# EasyEDA Pro project ProPrj_ArpGlass_2025-06-13_16-35-24_2025-06-13.epro, board PCB_ArpGlass
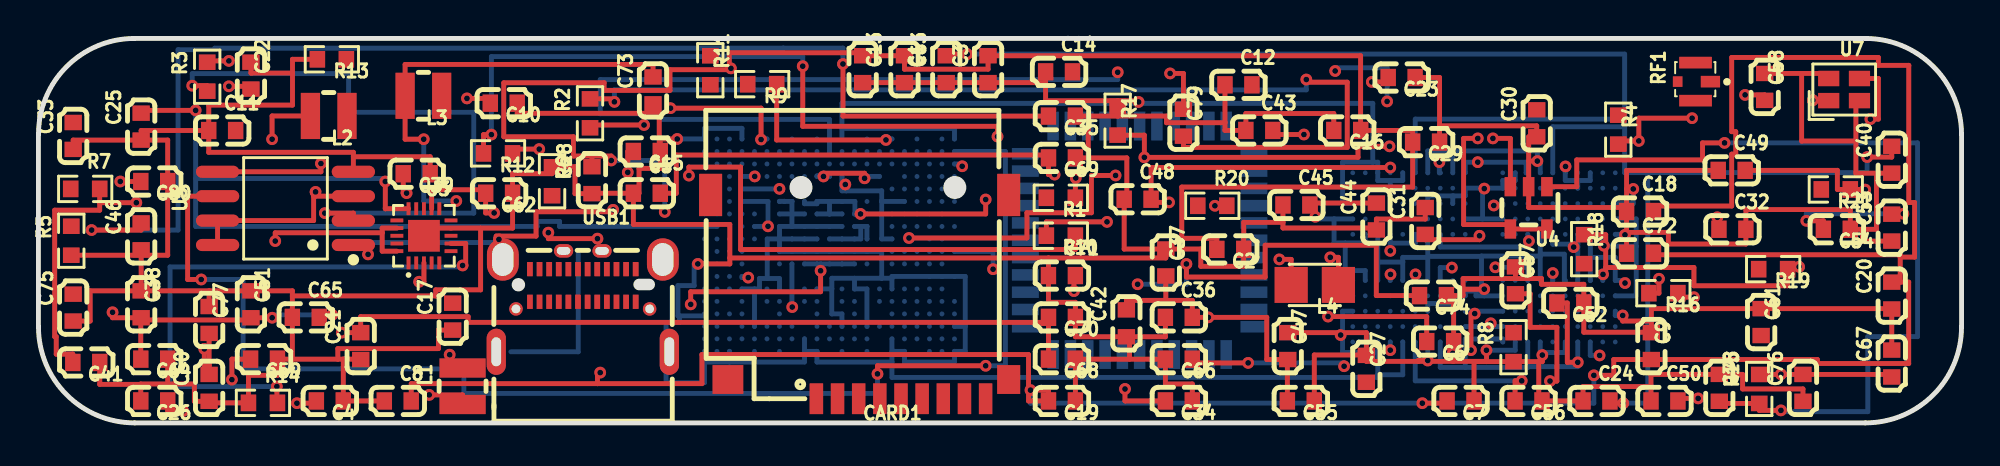
[diagram p1: board, top side]
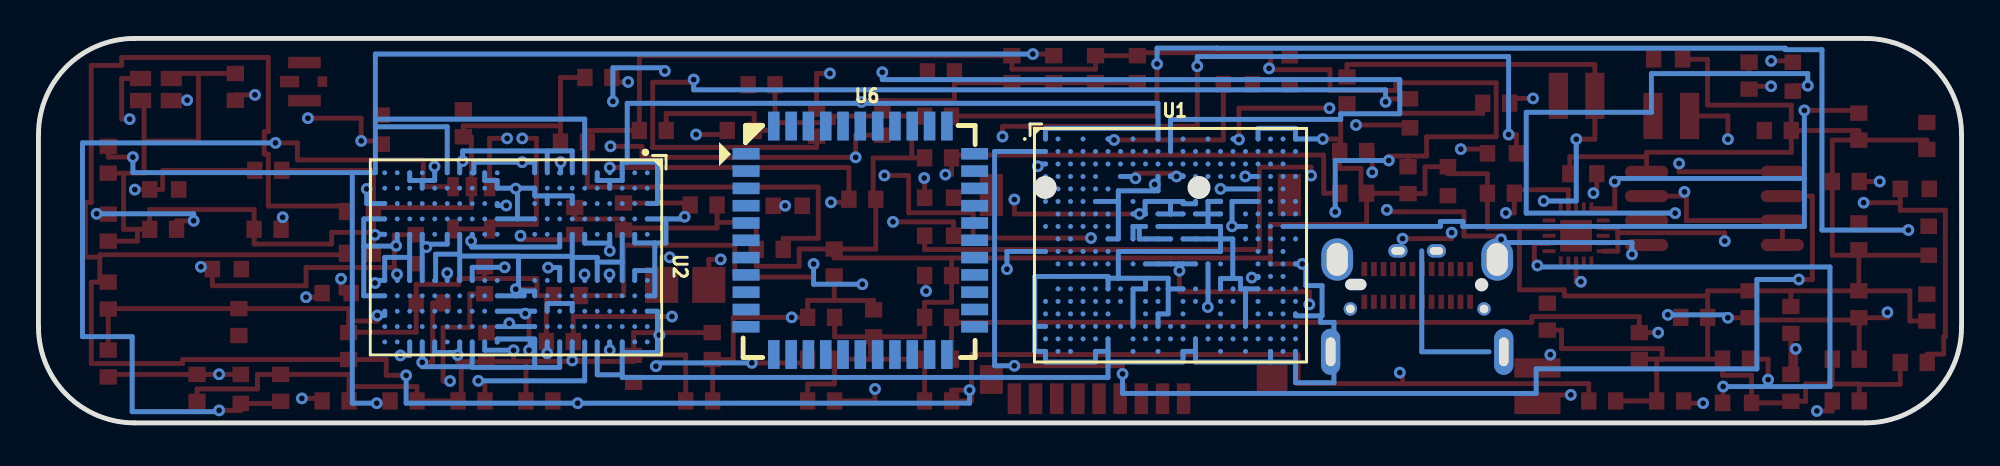
[diagram p2: board, bottom side, seen from below]

Outline 100 x 20 mm; copper layers: Top Layer, GND, Inner2, Bottom Layer. Coordinates in mm from the lower left corner of the outline.
Outline path: 0,15 arc(1.46,18.54) 5,20 95,20 arc(98.54,18.54) 100,15 100,5 arc(98.54,1.46) 95,0 5,0 arc(1.46,1.46) 0,5 0,15
Stack: Top Layer 0.035mm / Dielectric1 0.48mm PP er 4.5 / GND 0.035mm / Dielectric2 0.48mm FR4 er 4.5 / Inner2 0.035mm / Dielectric3 0.48mm PP er 4.5 / Bottom Layer 0.035mm

## Design rules (mm)
template: User Custom Config
spacing Default (default): track to track 0.152, other pairs 0 to 0.152
track width Default (default): min 0.254, default 0.254, max 25.4
differential pair differentialPair (default): width min 0.127, default 0.254, max 2.54; gap min 0.152, default 0.152
via Default (default): diameter min 0.61, default 0.61, max 100.025; hole min 0.305, default 0.305, max 59.995

## Placement (name value [footprint] x y rotation side)
C1  2.2uf  [C0603]  45.03 18.4 270 top
C2  100nf  [C0603]  61.97 9.03 180 top
C3  22uf  [C0603]  49.38 18.4 90 top
C4  22uf  [C0603]  15.15 1.14 180 top
C5  22uf  [C0603]  31.64 11.95 0 top
C6  22uf  [C0603]  72.89 4.23 180 top
C7  22uf  [C0603]  73.95 1.14 180 top
C8  22uf  [C0603]  18.69 1.14 0 top
C9  22uf  [C0603]  83.87 4 270 top
C10  10uf  [C0603]  24.2 16.63 180 top
C11  220nf  [C0603]  9.55 15.21 0 top
C12  1uf  [C0603]  62.4 17.59 0 top
C13  100nf  [C0603]  42.86 18.4 270 top
C14  470nf  [C0603]  53.07 18.26 0 top
C15  1uf  [C0603]  31.64 14.12 180 top
C16  2.2uf  [C0603]  68.06 15.21 180 top
C17  470nf  [C0603]  21.54 5.53 90 top
C18  2.2uf  [C0603]  83.28 11 0 top
C19  2.2uf  [C0603]  53.22 1.14 180 top
C20  2.2uf  [C0603]  96.37 6.62 90 top
C21  2.2uf  [C0603]  16.76 4 90 top
C22  2.2uf  [C0603]  11.05 18.07 270 top
C23  2.2uf  [C0603]  70.89 17.97 180 top
C24  10uf  [C0603]  81.02 1.14 0 top
C25  2.2uf  [C0603]  5.34 15.41 90 top
C26  10uf  [C0603]  6.02 1.14 180 top
C27  100nf  [C0603]  69.05 2.81 270 top
C28  100nf  [C0603]  28.78 12.63 90 top
C29  100nf  [C0603]  72.16 14.61 180 top
C30  100nf  [C0603]  77.91 15.58 90 top
C31  12pf  [C0603]  72.11 10.5 90 top
C32  12pf  [C0603]  88.09 10.07 0 top
C33  1nf  [C0603]  1.81 14.93 90 top
C34  22uf  [C0603]  59.3 1.14 180 top
C35  2.2nf  [C0603]  53.22 15.96 180 top
C36  1uf  [C0603]  59.3 5.49 0 top
C37  1uf  [C0603]  58.62 8.34 270 top
C38  2.2nf  [C0603]  5.34 6.17 270 top
C39  2.2nf  [C0603]  19.67 12.96 180 top
C40  1uf  [C0603]  96.37 13.69 90 top
C41  100nf  [C0603]  2.49 3.14 180 top
C42  100nf  [C0603]  56.57 5.18 90 top
C43  100nf  [C0603]  63.49 15.21 0 top
C44  100nf  [C0603]  69.57 10.74 90 top
C45  1uf  [C0603]  65.41 11.34 0 top
C46  1uf  [C0603]  5.34 9.7 90 top
C47  1uf  [C0603]  64.96 4 270 top
C48  100nf  [C0603]  57.16 11.63 0 top
C49  100nf  [C0603]  88.05 13.14 0 top
C50  1uf  [C0603]  84.55 1.14 0 top
C51  1uf  [C0603]  11.05 6.17 270 top
C52  1uf  [C0603]  79.66 6.24 180 top
C53  100nf  [C0603]  96.37 10.16 90 top
C54  100nf  [C0603]  93.52 10.07 180 top
C55  100nf  [C0603]  65.64 1.14 180 top
C56  100nf  [C0603]  77.48 1.14 180 top
C57  1uf  [C0603]  76.8 7.42 270 top
C58  22uf  [C0603]  89.76 17.48 270 top
C59  4.7uf  [C0603]  11.73 3.32 180 top
C60  22uf  [C0603]  8.87 1.82 90 top
C61  1uf  [C0603]  89.58 5.24 270 top
C62  22uf  [C0603]  23.95 11.95 180 top
C63  22uf  [C0603]  47.21 18.4 90 top
C64  22uf  [C0603]  6.02 3.32 180 top
C65  1uf  [C0603]  13.9 5.49 0 top
C66  22uf  [C0603]  59.3 3.32 180 top
C67  22uf  [C0603]  96.37 3.09 90 top
C68  22uf  [C0603]  53.22 3.32 180 top
C69  22uf  [C0603]  53.22 13.79 180 top
C70  1uf  [C0603]  53.22 5.49 180 top
C71  1uf  [C0603]  53.22 7.66 0 top
C72  22uf  [C0603]  83.28 8.82 0 top
C73  22uf  [C0603]  31.96 17.3 90 top
C74  1nf  [C0603]  72.52 6.62 180 top
C75  100nf  [C0603]  1.81 6 90 top
C76  100nf  [C0603]  91.75 1.82 90 top
C77  22uf  [C0603]  8.87 5.36 270 top
C78  100nf  [C0603]  87.41 1.82 270 top
C79  12pf  [C0603]  59.54 15.62 270 top
C80  22uf  [C0603]  6.02 12.56 180 top
CARD1  TF PUSH  [TF-SMD_TF-PUSH]  42.7 6.56 180 top
L1  1uH  [IND-SMD_L2.5-W2.0_AHP252010X]  22.05 1.91 90 top
L2  1uH  [IND-SMD_L2.5-W2.0_AHP252010X]  15.09 15.97 180 top
L3  1uH  [IND-SMD_L2.5-W2.0_AHP252010X]  20.02 17.02 180 top
L4  2.2uH  [IND-SMD_L2.5-W2.0_WPN252012H]  66.37 7.18 180 top
R1  10  [R0603]  53.16 11.71 180 top
R2  10k  [R0603]  28.68 16.1 90 top
R3  10k  [R0603]  8.77 18.01 90 top
R4  10k  [R0603]  82.15 15.25 270 top
R5  150k  [R0603]  1.71 9.48 90 top
R6  10k  [R0603]  26.71 12.57 270 top
R7  20k  [R0603]  2.43 12.17 0 top
R8  6.04k  [R0603]  76.7 3.94 90 top
R9  10  [R0603]  37.63 17.62 180 top
R10  10k  [R0603]  53.16 9.74 180 top
R11  0  [R0603]  34.94 18.35 270 top
R12  100  [R0603]  23.9 14.02 180 top
R13  240  [R0603]  15.26 18.92 180 top
R14  510  [R0603]  11.67 1.04 0 top
R15  10k  [R0603]  89.48 1.77 90 top
R16  232k  [R0603]  84.5 6.75 180 top
R17  49.9k  [R0603]  56.12 15.72 270 top
R18  240  [R0603]  80.38 9.04 270 top
R19  240  [R0603]  90.2 8 180 top
R20  100k  [R0603]  61.04 11.3 0 top
R21  100k  [R0603]  93.46 12.15 180 top
RF1  IPEX-4  [IPEX-SMD_4P-L1.8-W1.7-LS2.0]  86.09 17.75 90 top
U1  H616_C5365289  [BGA-284_L14.0-W12.0-P0.65-TL]  41.13 9.25 180 bottom
U2  K4F8E304HB-MGCJ  [BGA-200_L15.0-W10.0_K4F8E304HB-MGCJ]  75.17 8.61 270 bottom
U3  AXP313A_C5365290  [QFN-20_L3.0-W3.0-P0.40-BL-EP1.7]  20.04 9.73 0 top
U4  SY8089AAC  [SOT-23-5_L2.9-W1.6-P0.95-LS2.8-BL]  77.49 11.19 180 top
U5  W25Q128JWSIQ  [SOIC-8_L5.3-W5.3-P1.27-LS8.0-BL]  12.84 11.16 90 top
U6  -  [COMM-SMD-44_L12.0-W12.0-P0.90-TL_BL-R8189FTV]  57.26 9.5 180 bottom
U7  24MHz  [CRYSTAL-SMD_4P-L2.0-W1.6-BL-2]  93.89 17.34 0 top
USB1  UT12113-11601-7H  [USB-C-SMD_UT12113-11601-7H]  28.31 6.32 0 top

## Footprints (pads in the part's own frame, mm; a bottom-side part is the same pattern mirrored in y, then rotated)
BGA-200_L15.0-W10.0_K4F8E304HB-MGCJ
  round 0.248 smd: A1(-4.4,6.825) A2(-3.6,6.825) A3(-2.8,6.825) A4(-2,6.825) A5(-1.2,6.825) A8(1.2,6.825) A9(2,6.825) A10(2.8,6.825) A11(3.6,6.825) A12(4.4,6.825) AA1(-4.4,-6.175) AA2(-3.6,-6.175) AA3(-2.8,-6.175) AA4(-2,-6.175) AA5(-1.2,-6.175) AA8(1.2,-6.175) AA9(2,-6.175) AA10(2.8,-6.175) AA11(3.6,-6.175) AA12(4.4,-6.175) AB1(-4.4,-6.825) AB2(-3.6,-6.825) AB3(-2.8,-6.825) AB4(-2,-6.825) AB5(-1.2,-6.825) AB8(1.2,-6.825) AB9(2,-6.825) AB10(2.8,-6.825) AB11(3.6,-6.825) AB12(4.4,-6.825) B1(-4.4,6.175) B2(-3.6,6.175) B3(-2.8,6.175) B4(-2,6.175) B5(-1.2,6.175) B8(1.2,6.175) B9(2,6.175) B10(2.8,6.175) B11(3.6,6.175) B12(4.4,6.175) C1(-4.4,5.525) C2(-3.6,5.525) C3(-2.8,5.525) C4(-2,5.525) C5(-1.2,5.525) C8(1.2,5.525) C9(2,5.525) C10(2.8,5.525) C11(3.6,5.525) C12(4.4,5.525) D1(-4.4,4.875) D2(-3.6,4.875) D3(-2.8,4.875) D4(-2,4.875) D5(-1.2,4.875) D8(1.2,4.875) D9(2,4.875) D10(2.8,4.875) D11(3.6,4.875) D12(4.4,4.875) E1(-4.4,4.225) E2(-3.6,4.225) E3(-2.8,4.225) E4(-2,4.225) E5(-1.2,4.225) E8(1.2,4.225) E9(2,4.225) E10(2.8,4.225) E11(3.6,4.225) E12(4.4,4.225) F1(-4.4,3.575) F2(-3.6,3.575) F3(-2.8,3.575) F4(-2,3.575) F5(-1.2,3.575) F8(1.2,3.575) F9(2,3.575) F10(2.8,3.575) F11(3.6,3.575) F12(4.4,3.575) G1(-4.4,2.925) G2(-3.6,2.925) G3(-2.8,2.925) G4(-2,2.925) G5(-1.2,2.925) G8(1.2,2.925) G9(2,2.925) G10(2.8,2.925) G11(3.6,2.925) G12(4.4,2.925) H1(-4.4,2.275) H2(-3.6,2.275) H3(-2.8,2.275) H4(-2,2.275) H5(-1.2,2.275) H8(1.2,2.275) H9(2,2.275) H10(2.8,2.275) H11(3.6,2.275) H12(4.4,2.275) J1(-4.4,1.625) J2(-3.6,1.625) J3(-2.8,1.625) J4(-2,1.625) J5(-1.2,1.625) J8(1.2,1.625) J9(2,1.625) J10(2.8,1.625) J11(3.6,1.625) J12(4.4,1.625) K1(-4.4,0.975) K2(-3.6,0.975) K3(-2.8,0.975) K4(-2,0.975) K5(-1.2,0.975) K8(1.2,0.975) K9(2,0.975) K10(2.8,0.975) K11(3.6,0.975) K12(4.4,0.975) N1(-4.4,-0.975) N2(-3.6,-0.975) N3(-2.8,-0.975) N4(-2,-0.975) N5(-1.2,-0.975) N8(1.2,-0.975) N9(2,-0.975) N10(2.8,-0.975) N11(3.6,-0.975) N12(4.4,-0.975) P1(-4.4,-1.625) P2(-3.6,-1.625) P3(-2.8,-1.625) P4(-2,-1.625) P5(-1.2,-1.625) P8(1.2,-1.625) P9(2,-1.625) P10(2.8,-1.625) P11(3.6,-1.625) P12(4.4,-1.625) R1(-4.4,-2.275) R2(-3.6,-2.275) R3(-2.8,-2.275) R4(-2,-2.275) R5(-1.2,-2.275) R8(1.2,-2.275) R9(2,-2.275) R10(2.8,-2.275) R11(3.6,-2.275) R12(4.4,-2.275) T1(-4.4,-2.925) T2(-3.6,-2.925) T3(-2.8,-2.925) T4(-2,-2.925) T5(-1.2,-2.925) T8(1.2,-2.925) T9(2,-2.925) T10(2.8,-2.925) T11(3.6,-2.925) T12(4.4,-2.925) U1(-4.4,-3.575) U2(-3.6,-3.575) U3(-2.8,-3.575) U4(-2,-3.575) U5(-1.2,-3.575) U8(1.2,-3.575) U9(2,-3.575) U10(2.8,-3.575) U11(3.6,-3.575) U12(4.4,-3.575) V1(-4.4,-4.225) V2(-3.6,-4.225) V3(-2.8,-4.225) V4(-2,-4.225) V5(-1.2,-4.225) V8(1.2,-4.225) V9(2,-4.225) V10(2.8,-4.225) V11(3.6,-4.225) V12(4.4,-4.225) W1(-4.4,-4.875) W2(-3.6,-4.875) W3(-2.8,-4.875) W4(-2,-4.875) W5(-1.2,-4.875) W8(1.2,-4.875) W9(2,-4.875) W10(2.8,-4.875) W11(3.6,-4.875) W12(4.4,-4.875) Y1(-4.4,-5.525) Y2(-3.6,-5.525) Y3(-2.8,-5.525) Y4(-2,-5.525) Y5(-1.2,-5.525) Y8(1.2,-5.525) Y9(2,-5.525) Y10(2.8,-5.525) Y11(3.6,-5.525) Y12(4.4,-5.525)
BGA-284_L14.0-W12.0-P0.65-TL
  round 0.256 smd: A1(-6.5,5.525) A2(-5.85,5.525) A4(-4.55,5.525) A6(-3.25,5.525) A8(-1.95,5.525) A10(-0.65,5.525) A12(0.65,5.525) A14(1.95,5.525) A16(3.25,5.525) A18(4.55,5.525) A19(5.2,5.525) A20(5.849,5.525) A21(6.5,5.525) B1(-6.5,4.875) B2(-5.85,4.875) B3(-5.2,4.875) B4(-4.55,4.875) B5(-3.9,4.875) B6(-3.25,4.875) B7(-2.6,4.875) B8(-1.95,4.875) B9(-1.3,4.875) B10(-0.65,4.875) B11(0,4.875) B12(0.65,4.875) B13(1.3,4.875) B14(1.95,4.875) B15(2.6,4.875) B16(3.25,4.875) B17(3.9,4.875) B18(4.55,4.875) B19(5.2,4.875) B20(5.849,4.875) B21(6.5,4.875) C1(-6.5,4.225) C2(-5.85,4.225) C3(-5.2,4.225) C4(-4.55,4.225) C5(-3.9,4.225) C6(-3.25,4.225) C7(-2.6,4.225) C8(-1.95,4.225) C9(-1.3,4.225) C10(-0.65,4.225) C11(0,4.225) C12(0.65,4.225) C13(1.3,4.225) C14(1.95,4.225) C15(2.6,4.225) C16(3.25,4.225) C17(3.9,4.225) C18(4.55,4.225) C19(5.2,4.225) C20(5.849,4.225) D1(-6.5,3.575) D2(-5.85,3.575) D3(-5.2,3.575) D4(-4.55,3.575) D5(-3.9,3.575) D7(-2.6,3.575) D10(-0.65,3.575) D11(0,3.575) D12(0.65,3.575) D13(1.3,3.575) D14(1.95,3.575) D15(2.6,3.575) D16(3.25,3.575) D18(4.55,3.575) D19(5.2,3.575) D20(5.849,3.575) D21(6.5,3.575) E2(-5.85,2.925) E3(-5.2,2.925) E4(-4.55,2.925) E5(-3.9,2.925) E6(-3.25,2.925) E18(4.55,2.925) E19(5.2,2.925) E20(5.849,2.925) F1(-6.5,2.275) F2(-5.85,2.275) F3(-5.2,2.275) F4(-4.55,2.275) F5(-3.9,2.275) F8(-1.95,2.275) F9(-1.3,2.275) F10(-0.65,2.275) F11(0,2.275) F12(0.65,2.275) F13(1.3,2.275) F14(1.95,2.275) F15(2.6,2.275) F18(4.55,2.275) F19(5.2,2.275) F20(5.849,2.275) F21(6.5,2.275) G2(-5.85,1.625) G3(-5.2,1.625) G4(-4.55,1.625) G5(-3.9,1.625) G6(-3.25,1.625) G8(-1.95,1.625) G9(-1.3,1.625) G10(-0.65,1.625) G11(0,1.625) G12(0.65,1.625) G13(1.3,1.625) G14(1.95,1.625) G15(2.6,1.625) G17(3.9,1.625) G18(4.55,1.625) G19(5.2,1.625) G20(5.849,1.625) G21(6.5,1.625) H1(-6.5,0.975) H2(-5.85,0.975) H3(-5.2,0.975) H4(-4.55,0.975) H5(-3.9,0.975) H6(-3.25,0.975) H8(-1.95,0.975) H9(-1.3,0.975) H10(-0.65,0.975) H11(0,0.975) H12(0.65,0.975) H13(1.3,0.975) H14(1.95,0.975) H15(2.6,0.975) H17(3.9,0.975) H18(4.55,0.975) H19(5.2,0.975) H20(5.849,0.975) J2(-5.85,0.325) J3(-5.2,0.325) J6(-3.25,0.325) J8(-1.95,0.325) J9(-1.3,0.325) J10(-0.65,0.325) J11(0,0.325) J12(0.65,0.325) J13(1.3,0.325) J14(1.95,0.325) J15(2.6,0.325) J17(3.9,0.325) J18(4.55,0.325) J19(5.2,0.325) J20(5.849,0.325) J21(6.5,0.325) K1(-6.5,-0.325) K2(-5.85,-0.325) K3(-5.2,-0.325) K4(-4.55,-0.325) K5(-3.9,-0.325) K6(-3.25,-0.325) K8(-1.95,-0.325) K9(-1.3,-0.325) K10(-0.65,-0.325) K11(0,-0.325) K12(0.65,-0.325) K13(1.3,-0.325) K14(1.95,-0.325) K15(2.6,-0.325) K18(4.55,-0.325) K19(5.2,-0.325) K20(5.849,-0.325) L2(-5.85,-0.975) L3(-5.2,-0.975) L4(-4.55,-0.975) L5(-3.9,-0.975) L6(-3.25,-0.975) L8(-1.95,-0.975) L9(-1.3,-0.975) L10(-0.65,-0.975) L11(0,-0.975) L12(0.65,-0.975) L13(1.3,-0.975) L14(1.95,-0.975) L15(2.6,-0.975) L18(4.55,-0.975) L19(5.2,-0.975) L20(5.849,-0.975) L21(6.5,-0.975) M1(-6.5,-1.625) M2(-5.85,-1.625) M3(-5.2,-1.625) M18(4.55,-1.625) M19(5.2,-1.625) M20(5.849,-1.625) N2(-5.85,-2.275) N3(-5.2,-2.275) N4(-4.55,-2.275) N5(-3.9,-2.275) N6(-3.25,-2.275) N7(-2.6,-2.275) N9(-1.3,-2.275) N10(-0.65,-2.275) N12(0.65,-2.275) N13(1.3,-2.275) N15(2.6,-2.275) N16(3.25,-2.275) N18(4.55,-2.275) N19(5.2,-2.275) N20(5.849,-2.275) N21(6.5,-2.275) P1(-6.5,-2.925) P2(-5.85,-2.925) P3(-5.2,-2.925) P4(-4.55,-2.925) P5(-3.9,-2.925) P6(-3.25,-2.925) P7(-2.6,-2.925) P9(-1.3,-2.925) P10(-0.65,-2.925) P12(0.65,-2.925) P13(1.3,-2.925) P15(2.6,-2.925) P16(3.25,-2.925) P18(4.55,-2.925) P20(5.849,-2.925) P21(6.5,-2.925) R1(-6.5,-3.575) R2(-5.85,-3.575) R3(-5.2,-3.575) R4(-4.55,-3.575) R5(-3.9,-3.575) R6(-3.25,-3.575) R9(-1.3,-3.575) R12(0.65,-3.575) R15(2.6,-3.575) R18(4.55,-3.575) R19(5.2,-3.575) R20(5.849,-3.575) R21(6.5,-3.575) T1(-6.5,-4.225) T2(-5.85,-4.225) T3(-5.2,-4.225) T4(-4.55,-4.225) T5(-3.9,-4.225) T6(-3.25,-4.225) T7(-2.6,-4.225) T8(-1.95,-4.225) T9(-1.3,-4.225) T10(-0.65,-4.225) T11(0,-4.225) T12(0.65,-4.225) T14(1.95,-4.225) T15(2.6,-4.225) T16(3.25,-4.225) T17(3.9,-4.225) T18(4.55,-4.225) T20(5.849,-4.225) T21(6.5,-4.225) U1(-6.5,-4.875) U2(-5.85,-4.875) U3(-5.2,-4.875) U4(-4.55,-4.875) U5(-3.9,-4.875) U6(-3.25,-4.875) U8(-1.95,-4.875) U9(-1.3,-4.875) U10(-0.65,-4.875) U11(0,-4.875) U12(0.65,-4.875) U13(1.3,-4.875) U14(1.95,-4.875) U15(2.6,-4.875) U16(3.25,-4.875) U17(3.9,-4.875) U18(4.55,-4.875) U19(5.2,-4.875) U20(5.849,-4.875) U21(6.5,-4.875) V1(-6.5,-5.525) V2(-5.85,-5.525) V3(-5.2,-5.525) V5(-3.9,-5.525) V8(-1.95,-5.525) V10(-0.65,-5.525) V12(0.65,-5.525) V15(2.6,-5.525) V17(3.9,-5.525) V19(5.2,-5.525) V20(5.849,-5.525) V21(6.5,-5.525)
C0603
  rect 0.8x0.9 smd: 1(-0.7,0) 2(0.7,0)
COMM-SMD-44_L12.0-W12.0-P0.90-TL_BL-R8189FTV
  rect 1.4x0.6 smd: 1(-5.944,4.5) 2(-5.944,3.6) 3(-5.944,2.7) 4(-5.944,1.8) 5(-5.944,0.9) 6(-5.944,0) 7(-5.944,-0.9) 8(-5.944,-1.8) 9(-5.944,-2.7) 10(-5.944,-3.6) 11(-5.944,-4.5) 23(5.944,-4.5) 24(5.944,-3.6) 25(5.944,-2.7) 26(5.944,-1.8) 27(5.944,-0.9) 28(5.944,0) 29(5.944,0.9) 30(5.944,1.8) 31(5.944,2.7) 32(5.944,3.6) 33(5.944,4.5)
  rect 0.6x1.5 smd: 12(-4.5,-5.944) 13(-3.6,-5.944) 14(-2.7,-5.944) 15(-1.8,-5.944) 16(-0.9,-5.944) 17(0,-5.944) 18(0.9,-5.944) 19(1.8,-5.944) 20(2.7,-5.944) 21(3.6,-5.944) 22(4.5,-5.944) 34(4.5,5.944) 35(3.6,5.944) 36(2.7,5.944) 37(1.8,5.944) 38(0.9,5.944) 39(0,5.944) 40(-0.9,5.944) 41(-1.8,5.944) 42(-2.7,5.944) 43(-3.6,5.944) 44(-4.5,5.944)
CRYSTAL-SMD_4P-L2.0-W1.6-BL-2
  rect 1.1x0.8 smd: 1(-0.8,-0.575) 2(0.8,-0.575) 3(0.8,0.575) 4(-0.8,0.575)
IND-SMD_L2.5-W2.0_AHP252010X
  rect 1x2.4 smd: 1(-0.95,0) 2(0.95,0)
IND-SMD_L2.5-W2.0_WPN252012H
  rect 1.724x1.87 smd: 1(1.228,0) 2(-1.228,0)
IPEX-SMD_4P-L1.8-W1.7-LS2.0
  rect 0.6x1 smd: 1(0.001,-0.852)
  rect 0.6x1.7 smd: 2(0.99,-0.077) 4(-0.99,-0.077)
  rect 0.55x0.5 smd: 3(0.001,0.852)
QFN-20_L3.0-W3.0-P0.40-BL-EP1.7
  rect 0.2x0.665 smd: 1(-0.8,-1.407) 2(-0.4,-1.407) 3(0,-1.407) 4(0.4,-1.407) 5(0.8,-1.407) 11(0.8,1.407) 12(0.4,1.407) 13(0,1.407) 14(-0.4,1.407) 15(-0.8,1.407)
  rect 0.665x0.2 smd: 6(1.407,-0.8) 7(1.407,-0.4) 8(1.407,0) 9(1.407,0.4) 10(1.407,0.8) 16(-1.407,0.8) 17(-1.407,0.4) 18(-1.407,0) 19(-1.407,-0.4) 20(-1.407,-0.8)
  rect 1.65x1.65 smd: 21(0,0)
R0603
  rect 0.806x0.864 smd: 1(-0.753,0) 2(0.753,0)
SOIC-8_L5.3-W5.3-P1.27-LS8.0-BL
  oval 0.63x2.25 smd: 1(-1.905,-3.53) 2(-0.635,-3.53) 3(0.635,-3.53) 4(1.905,-3.53) 5(1.905,3.53) 6(0.635,3.53) 7(-0.635,3.53) 8(-1.905,3.53)
SOT-23-5_L2.9-W1.6-P0.95-LS2.8-BL
  rect 0.6x1 smd: 1(-0.95,-1.1) 2(0,-1.1) 3(0.95,-1.1) 4(0.95,1.1) 5(-0.95,1.1)
TF-SMD_TF-PUSH
  rect 0.7x1.6 smd: 1(2.25,5.3) 2(1.15,5.3) 3(0.05,5.3) 4(-1.05,5.3) 5(-2.15,5.3) 6(-3.25,5.3) 7(-4.35,5.3) 8(-5.45,5.3) CD(-6.55,5.3)
  rect 1.2x1.5 smd: 10(-7.75,4.3)
  rect 1.2x2.2 smd: 11(-7.75,-5.3) 12(7.75,-5.3)
  rect 1.6x1.5 smd: 13(6.85,4.3)
USB-C-SMD_UT12113-11601-7H
  round 0.7 hole 0.45: 1(-3.475,-0.395) 1(3.475,-0.395)
  oval 1x2.4 hole 0.5x1.5: 2(-4.5,-2.625) 2(4.5,-2.625)
  oval 1x0.7 hole 0.7x0.4: 2(-1,2.625) 2(1,2.625)
  oval 1.65x2.2 hole 1.1x1.7: 13(-4.16,2.176) 13(4.16,2.176)
  rect 0.3x0.74 smd: A1(-2.75,1.675) A2(-2.25,1.675) A3(-1.75,1.675) A4(-1.25,1.675) A5(-0.75,1.675) A6(-0.25,1.675) A7(0.25,1.675) A8(0.75,1.675) A9(1.25,1.675) A10(1.75,1.675) A11(2.25,1.675) A12(2.75,1.675) B1(2.75,-0.025) B2(2.251,-0.025) B3(1.75,-0.025) B4(1.25,-0.025) B5(0.75,-0.025) B6(0.251,-0.025) B7(-0.25,-0.025) B8(-0.75,-0.025) B9(-1.25,-0.025) B10(-1.75,-0.025) B11(-2.25,-0.025) B12(-2.749,-0.025)

## Nets
As in the schematic, except:
VCC-PC: C1.1 C2.2 C3.2 C13.1 C16.1 C28.2 C29.2 C62.2 U1.D10 U1.E18 U1.F5 U1.J6 U1.M18 U3.12
VCC-PG: C24.2 C25.2 C26.1 C27.2 C30.2 C40.2 C41.2 C56.2 C57.2 C58.2 C63.2 R7.2 R10.2 U1.D7 U1.D11 U1.D12 U1.F18 U1.H17 U1.H20 U1.L14 U2.F1 U2.F12 U2.G4 U2.G9 U2.T4 U2.T9 U2.U1 U2.U12 U3.15

Pads without a net: U1 B17 B18 C11 C16 C18 D14 N13 N16 N19 N20 N21 P16 P18 P20 P21 R15 R19 T20 U15 U16 U18 U19 U20 V20; U2 A1 A2 A11 A12 AA1 AA12 AB1 AB2 AB11 AB12 B1 B12 G11 K5 K8 N5 N8; U3 10; USB1 13

## Via types
v1: diameter 0.61, hole 0.305, Top Layer to Bottom Layer, 159 vias

## Routing (per net, layer and track width the routed paths; a pad name or vN(x,y) marks a point on that pad's centre or on a via; arc(x,y) is an arc through that point)
GND: length 656.1
  Top Layer w0.254: C36.1 58.6,4.48 56.74,4.48 ; C40.1 95.57,12.99 ; 95.57,12.99 94.51,12.99 94.51,14.66 ; 95.57,12.99 95.57,10.07 94.85,10.07 ; C76.1 91.75,1.77 88.62,1.77 88.62,2.52 C78.1 83.85,2.52 83.85,1.89 ; 73.54,3.35 v1(73.54,3.62) ; 73.54,3.35 73.54,3.2 71.75,3.2 ; 73.54,3.35 73.59,3.35 ; C12.1 61.7,15.62 ; 61.7,15.62 61.7,15.21 62.78,15.21 62.78,16.1 67.36,16.1 C16.2 ; 61.7,15.62 58.66,15.62 58.66,15.96 56.12,15.96 ; v1(75.3,3.78) 75.3,3.78 75.3,3.2 ; 72.86,15.45 77.91,15.45 C30.1 77.49,14.89 77.49,13.62 ; 72.86,15.45 72.86,17.97 C23.1 ; 72.86,15.45 C29.1 ; 56.12,15.96 54.59,15.96 ; 56.12,15.96 R17.1 56.12,16.76 ; 52.37,17.7 52.37,16.76 56.12,16.76 ; 52.37,17.7 C14.1 ; 52.37,17.7 C3.1 C63.1 C1.2 C13.2 ; 13.21,18.2 13.21,16.53 8.85,16.53 C11.1 ; 13.21,18.2 11.05,18.2 C22.1 ; 13.21,18.2 13.21,18.92 R13.2 ; C15.1 32.28,14.12 32.28,16.1 31.96,16.1 ; C15.1 32.34,14.77 v1(33.22,14.77) ; C15.1 32.34,13.24 31.23,13.24 31.23,11.95 C5.1 ; 67.72,4.7 69.05,4.7 69.05,3.53 ; 67.72,4.7 v1(67.71,4.57) ; 67.72,4.7 C47.1 ; 83.87,4.72 80.36,4.72 C52.1 80.36,7.21 78.16,7.21 78.16,7.51 76.8,7.51 ; 83.87,4.72 C9.1 ; 83.87,4.72 83.87,5.3 ; 73.59,3.35 73.59,3.2 75.3,3.2 ; 73.59,3.35 C6.1 73.59,6.62 ; 13.2,6.61 20.66,6.61 20.66,6.92 22.99,6.92 22.99,10.13 ; 13.2,6.61 13.2,6.87 C51.1 8.87,6.87 ; 13.2,6.61 C65.1 13.2,3.32 ; 78.02,3.19 75.3,3.19 ; 78.02,3.19 78.2,3.19 v1(78.2,3.53) ; 78.02,3.19 78.02,1.14 C56.1 C24.1 80.32,1.89 83.85,1.89 ; 73.59,6.62 74.08,6.62 74.08,6.96 ; 73.59,6.62 C74.1 ; C46.1 5.34,8.72 ; 5.34,8.72 6.72,8.72 C80.1 6.72,14.71 C25.1 ; 5.34,8.72 R5.1 ; 5.34,8.72 C38.1 ; 8.87,6.87 C77.1 ; 8.87,6.87 C38.1 ; 75.3,3.19 74.65,3.19 C7.1 ; 75.3,3.19 75.3,3.2 ; 77.49,13.62 v1(77.94,13.62) ; 77.49,13.62 U4.2 77.49,11.2 82.58,11.2 ; 64.71,10.43 64.71,10.14 69.57,10.14 ; 64.71,10.43 62.67,10.43 C2.1 62.67,8.14 60.44,8.14 60.44,9.04 C37.1 ; 64.71,10.43 C45.1 ; 15.85,3.32 16.76,3.32 C21.1 ; 15.85,3.32 15.57,3.32 ; 15.85,3.32 C4.1 C8.1 ; 94.85,10.07 94.85,9.46 C53.1 ; 94.85,10.07 C54.1 94.22,11.1 88.79,11.1 C32.2 88.79,9.31 84.76,9.31 84.76,9.91 82.58,9.91 ; 56.74,4.48 56.74,3.32 ; 56.74,4.48 C42.1 53.92,4.48 C70.1 53.92,6.27 52.52,6.27 C71.1 52.52,8.58 ; C38.1 2.69,6.87 2.69,5.3 C75.1 ; 69.57,10.14 69.57,10.61 72.11,10.61 C31.2 ; 69.57,10.14 C44.1 ; 35.95,8.58 35.95,8.27 v1(34.29,8.27) ; 35.95,8.58 52.52,8.58 ; 35.95,8.58 35.95,10.33 30.94,10.33 C5.1 ; C41.1 3.19,2 5.32,2 ; C5.1 28.78,11.95 C28.1 27.9,11.93 27.9,13.32 R6.1 26.71,12.96 24.65,12.96 C62.1 24.65,10.13 22.99,10.13 ; 82.58,9.91 82.58,9.78 ; 82.58,9.91 C18.1 82.58,11.2 ; 82.58,9.78 v1(82.5,9.78) ; 82.58,9.78 C72.1 ; 91.68,18.18 93.09,18.18 U7.4 ; 91.68,18.18 91.68,14.66 94.51,14.66 ; 91.68,18.18 C58.1 ; 31.96,16.1 24.9,16.1 C10.1 ; 31.96,16.1 C73.1 ; 6.72,2.02 5.32,2.02 5.32,2 ; 6.72,2.02 8.11,2.02 8.11,1.12 C60.1 8.87,1.04 R14.1 10.92,2.47 12.43,2.47 C59.1 13.2,3.32 ; 6.72,2.02 C64.1 ; 71.75,3.2 71.75,3.24 v1(72.24,3.24) ; 71.75,3.2 69.05,3.2 C27.1 69.05,3.53 ; 76.8,7.51 C57.1 ; 76.8,7.51 74.08,7.51 74.08,6.96 ; 54.59,13.79 56.59,13.79 56.59,11.63 C48.1 56.46,9.04 C37.1 ; 54.59,13.79 54.59,15.96 ; 54.59,13.79 C69.1 ; 94.51,14.66 94.51,16.77 U7.2 ; 74.08,6.96 v1(75.18,6.96) ; C35.1 54.59,15.96 ; 82.58,11.2 82.58,12.17 ; v1(82.93,12.17) 82.58,12.17 ; 82.58,12.17 82.58,13.14 87.35,13.14 ; C37.1 58.62,8.58 52.52,8.58 ; C19.1 C68.1 56.74,3.32 ; 69.05,3.53 66.34,3.53 C55.1 ; 16.38,13.84 20.37,13.84 20.37,12.96 ; 16.38,13.84 U5.4 ; 16.38,13.84 16.38,14.08 8.85,14.08 C11.1 ; 22.99,10.13 U3.9 20.04,10.13 U3.21 ; 15.57,3.32 13.2,3.32 ; 15.57,3.32 15.57,3.86 20.8,3.86 20.8,4.83 C17.1 ; 83.85,1.89 C50.1 ; 83.87,5.3 83.87,5.94 C61.1 96.37,5.94 C20.1 C67.2 ; 83.87,5.3 82.38,5.3 v1(82.38,5.59) ; C34.1 60,2.02 58.6,2.02 58.6,3.32 56.74,3.32 ; C26.2 5.32,2 ; C11.1 5.34,15.21 C25.1 ; v1(57.21,16.7) 57.21,16.76 56.12,16.76 ; C25.1 1.81,14.71 C33.1
  Inner2 w0.254: v1(81.18,3.51) 81.18,3.73 78.2,3.73 v1(78.2,3.53) ; v1(75.18,6.96) 75.52,6.96 v1(75.52,5.18) ; 82.38,7.28 82.38,9.78 v1(82.5,9.78) ; 82.38,7.28 v1(82.5,7.28) ; 82.38,7.28 v1(82.38,5.59) ; v1(77.94,13.62) 77.94,13.34 ; 77.94,13.34 v1(79.41,13.34) ; 77.94,13.34 77.94,12.19 v1(75.18,12.19)
  Bottom Layer w0.254: v1(79.41,13.34) 79.39,13.34 U2.V1 79.39,12.61 80.04,12.61 ; 78.09,8.78 U2.T5 ; 78.09,8.78 78.09,8.68 ; 78.09,8.78 79.35,8.78 79.35,7.41 U2.V8 ; 70.94,8.37 70.94,8.61 72.24,8.61 ; 70.94,8.37 U2.E8 ; 70.94,8.37 69.64,8.37 ; 70.29,12.61 70.94,12.61 U2.E1 ; 70.29,12.61 U2.D2 ; 70.29,12.61 69.64,12.61 U2.C1 69.64,13.56 69.38,13.56 ; U2.AB5 82.5,9.81 v1(82.5,9.78) ; 75.09,10.61 75.09,12.19 v1(75.18,12.19) 75.18,12.21 ; 75.09,10.61 U2.K4 ; 75.09,10.61 U2.N4 ; 69.64,3.66 67.81,3.66 67.81,4.57 ; 69.64,3.66 69.64,2.5 ; 69.64,3.66 U2.C12 ; U1.H14 U1.H13 U1.H12 U1.H11 U1.H10 ; U1.H14 U1.G14 ; U1.H14 38.53,10.22 38.53,9.57 ; U2.K9 74.19,6.86 74.75,6.86 ; 44.38,7.52 U1.N6 ; 44.38,7.52 44.38,7.62 U1.M3 U1.M2 U1.M1 48.19,7.62 48.19,5.02 ; 44.38,7.52 43.85,7.52 ; U2.Y8 80.7,7.41 80.7,8.61 ; 41.78,15.32 41.78,16.62 57.21,16.62 ; 41.78,15.32 47.63,15.32 U1.A1 ; 41.78,15.32 U1.A10 ; v1(67.71,4.57) 67.81,4.57 ; 67.81,4.57 67.81,5.81 U2.A10 ; 73.54,11.81 U2.J3 ; 73.54,11.81 74.19,11.81 U2.K2 75.18,12.21 ; 73.54,11.81 72.24,11.81 U2.G3 ; U2.Y12 80.69,3.51 v1(81.18,3.51) ; U1.R21 34.63,5.57 33.33,5.57 ; U1.L21 v1(34.29,8.27) 34.09,8.27 34.09,7.14 33.25,7.14 33.25,5.57 33.33,5.57 ; 42.43,7.52 42.43,6.97 43.08,6.97 U1.T8 ; 42.43,7.52 41.25,7.52 41.25,6.97 ; 42.43,7.52 43.85,7.52 ; 33.33,5.57 33.33,5.23 32.64,5.23 32.64,2.09 34.63,2.09 34.63,3.17 ; 78.09,8.68 U2.T8 ; 78.09,8.68 75.04,8.68 75.04,8.66 ; U2.C5 69.64,8.37 ; 69.64,8.37 U2.C8 ; U1.T1 48.19,5.02 ; 48.19,5.02 48.19,3.72 U1.V1 47.63,3.17 45.03,3.17 45.03,3.72 44.38,3.72 ; v1(73.54,3.62) U2.J12 ; 44.38,3.72 U1.U6 ; 44.38,3.72 44.38,3.17 ; U1.G14 38.53,10.87 ; U1.G14 U1.G13 ; U1.G14 U1.F14 38.79,11.52 38.79,11.53 38.53,11.53 38.53,11.52 ; 74.75,6.86 75.04,6.86 75.04,8.66 ; 74.75,6.86 74.75,6.61 75.18,6.61 ; 75.52,5.01 U2.N11 ; 75.52,5.01 U2.K11 ; 75.52,5.01 v1(75.52,5.18) ; 44.38,3.17 40.48,3.17 U1.V12 39.83,3.72 ; 44.38,3.17 44.38,2.36 69.64,2.36 69.64,2.5 ; 72.24,8.61 U2.G8 ; 72.24,8.61 72.24,8.66 ; 37.23,6.97 U1.T17 ; 37.23,6.97 U1.N18 ; 37.23,6.97 37.49,6.97 37.49,7.51 37.9,7.51 ; 80.7,8.61 81.99,8.61 U2.AB8 82.5,7.41 v1(82.5,7.28) ; 80.7,8.61 80.7,9.81 U2.Y5 ; 80.04,12.61 U2.W2 ; 80.04,12.61 80.69,12.61 U2.Y1 ; 78.2,3.66 78.09,3.66 U2.T12 ; 78.2,3.66 79.39,3.66 U2.V12 ; 78.2,3.66 v1(78.2,3.53) ; 72.24,8.66 U2.G5 ; 72.24,8.66 75.04,8.66 ; 38.53,9.57 U1.J14 U1.J13 U1.J12 ; 38.53,9.57 38.53,8.92 U1.K14 U1.K13 U1.K12 U1.K11 U1.K10 U1.K8 43.85,8.92 43.85,7.52 ; 38.53,9.57 37.9,9.57 37.9,7.51 ; U2.P1 76.79,12.61 76.14,12.61 U2.N2 75.18,12.21 ; U1.T10 41.78,5.67 41.25,5.67 41.25,6.97 U1.N12 ; v1(75.18,6.96) 75.18,6.61 ; 75.18,6.61 U2.N9 ; 37.9,7.51 38.53,7.51 38.53,6.97 ; U2.J10 73.54,6.21 72.24,6.21 U2.G10 ; U2.P12 76.79,3.78 v1(75.3,3.78) ; U2.A3 67.81,11.41 67.81,13.56 69.38,13.56 ; 69.64,2.5 70.94,2.5 U2.E12 ; 69.38,13.56 69.38,16.62 57.21,16.62 ; 73.54,14.15 72.24,14.15 U2.G1 ; 73.54,14.15 U2.J1 ; 73.54,14.15 77.94,14.15 v1(77.94,13.62) 78.09,13.62 U2.T1 ; U1.A18 36.58,15.32 34.63,15.32 U1.A21 v1(33.22,14.77) ; v1(82.93,12.17) 82.93,11.41 U2.AB3 ; v1(57.21,16.7) 57.21,16.62 ; v1(82.38,5.59) 81.99,5.59 U2.AB10 ; 39.83,3.72 39.83,3.17 35.93,3.17 ; 39.83,3.72 U1.U13 ; 34.63,3.17 U1.V21 ; 34.63,3.17 35.93,3.17 ; 35.93,3.17 35.93,3.72 ; v1(72.24,3.24) U2.G12
VCC-5V: length 196.3
  Top Layer w0.254: 8.87,2.99 C77.2 ; 8.87,2.99 C60.2 ; 8.87,2.99 8.62,2.99 v1(8.62,3.85) ; U3.17 17.87,10.13 17.87,9.89 ; v1(70.25,14.39) 68.62,14.39 68.62,13.81 v1(57.51,13.81) 57.51,14.97 R17.2 ; v1(90.61,2.53) 90.61,2.52 ; 90.61,2.52 C76.2 96.37,2.52 C67.1 ; 90.61,2.52 89.48,2.52 ; 17.87,9.89 12.31,9.89 v1(12.31,9.46) ; 17.87,9.89 17.87,8.93 U3.20 ; v1(58.84,18.18) 59.54,18.18 C79.1 ; R16.1 85.25,6.54 v1(86.08,6.54) ; v1(62.9,3.12) 60,3.12 C66.1 ; v1(74.84,14.8) 74.11,14.8 74.11,10.32 76.54,10.32 U4.4 U4.5
  Inner2 w0.254: v1(12.31,9.46) 9.32,9.46 9.32,3.85 ; 9.32,3.85 9.32,0.58 11.16,0.58 11.16,0.51 11.44,0.51 11.44,0.44 69.19,0.44 69.19,0.93 ; 9.32,3.85 v1(8.62,3.85) ; v1(70.25,14.39) 70.25,14.8 v1(74.84,14.8) ; 90.61,4.57 90.61,6.54 v1(86.08,6.54) ; 90.61,4.57 70.88,4.57 70.88,0.93 69.19,0.93 ; 90.61,4.57 v1(90.61,2.53) ; v1(67.89,2.95) 69.19,2.95 69.19,0.93 ; v1(62.9,3.12) 62.9,18.18 v1(58.84,18.18) 58.84,13.81 v1(57.51,13.81)
  Bottom Layer w0.254: v1(67.89,2.95) 67.89,3.12 v1(62.9,3.12)
VCC-DRAM: length 423.2
  Top Layer w0.254: 66.4,11.44 66.11,11.44 C45.2 ; 66.4,11.44 C44.2 ; 66.4,11.44 v1(66.4,10.72) ; v1(19.14,11.95) 18.97,11.95 C39.2 ; v1(91.55,8.12) 90.96,8.12 90.96,7.13 86.08,7.13 86.08,8.08 81.5,8.08 ; v1(74.69,5.69) 74.49,5.69 v1(74.49,3.78) ; C49.2 93.54,13.14 93.54,12.15 94.99,12.15 v1(94.99,12.14) ; R18.1 81.5,9.79 81.5,8.08 ; v1(70.29,13.28) 57.86,13.28 C48.2 57.86,11.47 v1(58.79,11.47) ; 52.52,15.96 41.83,15.96 v1(41.83,18.67) ; 58.62,6.37 60,6.37 C36.2 v1(60.83,5.49) 63.87,5.49 63.87,3.3 64.94,3.3 ; 58.62,6.37 C37.2 ; 58.62,6.37 56.57,6.37 C42.2 ; v1(96.98,10.88) 96.37,10.88 C53.2 ; L1.1 22.05,1.46 v1(20.32,1.46) ; 81.5,8.08 81.5,7.73 v1(81.36,7.73) ; v1(33.92,6.17) 33.92,6.82 40.67,6.82 v1(40.67,7.91) ; v1(65.8,15) 64.19,15 C43.2 ; v1(91.93,10.51) 92.82,10.51 C54.2 ; C65.2 14.6,5.62 v1(15.27,5.62) ; 64.94,3.3 C55.2 ; 64.94,3.3 C47.2 ; C50.2 85.25,1.27 v1(86.3,1.27) ; 5.34,5.36 C38.2 3.85,5.47 v1(3.85,5.75) ; 5.34,5.36 5.32,5.36 C64.2 ; 5.34,5.36 11.05,5.36 C51.2 v1(12.15,5.47) ; v1(80.04,3.15) 79.5,3.15 79.5,6.24 C52.2 ; v1(2.76,10.03) 5.34,10.03 C46.2 ; R20.2 v1(61.17,11.3) ; v1(56.5,1.76) 56.5,1.14 C34.2 ; v1(56.01,12.87) 54.75,12.87 54.75,10.93 51.4,10.93 51.4,9.62 v1(45.27,9.62)
  Inner2 w0.254: 73.87,8.08 73.87,7.73 ; 73.87,8.08 v1(73.5,8.08) ; 73.87,8.08 73.87,8.95 ; 73.87,7.73 v1(71.61,7.73) v1(70.31,7.73) ; 73.87,7.73 73.87,5.69 v1(74.69,5.69) ; 34.5,1.46 45.27,1.46 v1(45.27,9.62) ; 34.5,1.46 v1(20.32,1.46) 20.32,5.62 19.14,5.62 ; 34.5,1.46 34.5,5.29 33.92,5.29 v1(33.92,6.17) ; 72.85,13.28 v1(70.29,13.28) ; 72.85,13.28 73.87,13.28 73.87,8.95 ; 72.85,13.28 v1(72.85,13.56) v1(74.84,13.56) ; v1(3.85,5.75) 2.76,5.75 v1(2.76,10.03) ; v1(94.99,12.14) 94.99,10.51 v1(91.93,10.51) 91.55,10.51 v1(91.55,8.12) ; v1(65.8,15) 65.8,9.98 66.4,9.98 ; v1(61.17,11.3) 61.17,11.47 v1(58.79,11.47) ; v1(75.76,8.09) 75.69,8.09 75.69,8.95 ; v1(77.5,9.46) 77.5,8.95 ; 77.5,8.95 77.5,7.8 v1(78.74,7.8) 78.74,9.15 v1(79.83,9.15) ; 77.5,8.95 75.69,8.95 ; v1(81.36,7.73) 81.36,9.21 v1(81.4,9.21) ; v1(70.31,7.73) 70.31,3.78 v1(70.29,3.78) ; v1(70.31,7.73) 70.29,7.73 v1(70.29,8.95) ; 19.14,5.62 v1(19.14,11.95) ; 19.14,5.62 v1(15.27,5.62) ; v1(80.04,3.15) 80.04,1.74 86.3,1.74 v1(86.3,1.27) 96.4,1.27 96.4,10.88 v1(96.98,10.88) ; v1(58.79,11.47) 56.01,11.47 v1(56.01,12.87) ; v1(58.79,11.47) 58.79,4.52 ; 58.79,4.52 58.79,1.76 ; 58.79,4.52 60.83,4.52 v1(60.83,5.49) ; 58.79,1.76 v1(56.5,1.76) ; 58.79,1.76 66.4,1.76 66.4,9.98 ; 66.4,9.98 v1(66.4,10.72) ; 75.69,8.95 75.68,8.95 ; 75.68,8.95 73.87,8.95 ; 75.68,8.95 v1(75.68,11.31)
  Bottom Layer w0.254: U2.AA8 81.34,7.73 v1(81.36,7.73) ; 67.95,7.92 67.95,6.61 U2.A9 ; 67.95,7.92 67.95,9.36 ; 67.95,7.92 68.99,7.92 U2.B8 ; v1(74.69,5.69) 74.69,5.81 ; 74.69,5.81 U2.K10 ; 74.69,5.81 U2.N10 ; 80.04,9.3 78.74,9.3 U2.U5 ; 80.04,9.3 U2.W5 ; 80.04,9.3 80.04,9.15 ; 83.08,9.2 83.08,6.61 U2.AB9 ; 83.08,9.2 83.08,10.61 U2.AB4 ; 83.08,9.2 81.4,9.2 v1(81.4,9.21) 81.34,9.21 U2.AA5 ; U2.R8 77.44,8.09 v1(75.76,8.09) ; U2.R5 77.44,9.46 77.47,9.46 ; 67.37,10.61 66.4,10.61 v1(66.4,10.72) ; 67.37,10.61 67.37,9.36 67.95,9.36 ; 67.37,10.61 U2.A4 ; 77.47,9.46 v1(77.5,9.46) ; 77.47,9.46 77.47,9.15 72.89,9.15 U2.H5 ; U2.R1 77.36,13.01 77.36,13.56 74.84,13.56 ; 70.29,9.35 v1(70.29,8.95) ; 70.29,9.35 71.59,9.35 U2.F5 ; 70.29,9.35 U2.D5 ; 74.19,2.89 U2.K12 74.19,4.36 74.42,4.36 ; 74.19,2.89 77.44,2.89 77.44,2.92 ; 74.19,2.89 72.89,2.89 U2.H12 ; 74.84,13.56 74.19,13.56 U2.K1 ; 74.84,13.56 v1(74.84,13.56) ; v1(78.74,7.8) U2.U8 ; 80.04,9.15 U2.W8 ; 80.04,9.15 v1(79.83,9.15) ; U2.N3 76.14,11.31 v1(75.68,11.31) ; 77.44,2.92 U2.R12 ; 77.44,2.92 80.04,2.92 v1(80.04,3.15) U2.W12 ; v1(96.98,10.88) 91.93,10.88 v1(91.93,10.51) ; v1(74.49,3.78) 74.42,3.78 74.42,4.36 ; 67.95,9.36 68.99,9.36 U2.B5 ; U2.F8 71.59,7.73 v1(71.61,7.73) ; 40.67,8.27 v1(40.67,7.91) ; 40.67,8.27 U1.L12 U1.L13 ; 40.67,8.27 U1.L11 U1.L10 42.43,8.27 ; v1(2.76,10.03) 7.26,10.03 7.26,19.42 9.17,19.42 9.17,19.49 38.74,19.49 38.74,19.5 41.83,19.5 v1(41.83,18.67) ; 74.42,4.36 76.14,4.36 U2.N12 ; v1(70.31,7.73) 70.29,7.73 U2.D8 ; v1(12.15,5.47) 12.15,5.62 v1(15.27,5.62) ; U2.H1 72.85,13.01 v1(72.85,13.56) ; U2.H8 72.89,8.08 v1(73.5,8.08) ; v1(70.29,3.78) U2.D12
VCC-PC: length 139.4
  Top Layer w0.254: v1(26.51,9.9) 26.51,9.58 v1(29.07,9.58) ; C2.2 61.27,9.6 59.45,9.6 59.45,12.27 71.46,12.27 71.46,15.21 C16.1 68.75,15.21 68.75,19.1 C3.2 49.38,18.4 45.03,18.4 C1.1 C13.1 42.86,19.25 35.92,19.25 35.92,18.44 ; 35.92,18.44 v1(36.01,18.44) ; 35.92,18.44 35.92,18.37 32.84,18.37 32.84,17.3 29.41,17.3 29.41,17.69 24.2,17.69 24.2,14.88 27.82,14.88 27.82,13.88 28.78,13.88 ; v1(29.79,13.65) 29.79,13.88 28.78,13.88 ; v1(23.69,10.92) 23.25,10.92 C62.2 23.25,12.13 20.44,12.13 U3.12 ; 28.78,13.88 C28.2
  Inner2 w0.254: v1(29.07,9.58) 29.07,9.86 32.68,9.86 32.68,11.08 32.57,11.08 v1(32.57,10.97) ; 36.91,12.18 36.01,12.18 v1(36.01,18.44) ; 36.91,12.18 36.91,9.47 ; 36.91,12.18 v1(38.53,12.18) ; 36.91,9.47 41.96,9.47 v1(41.96,12.4) ; 36.91,9.47 v1(36.91,7.56) ; v1(26.51,9.9) 26.51,10.92 v1(23.69,10.92)
  Bottom Layer w0.254: 43.85,11.52 45.03,11.52 ; 43.85,11.52 43.85,9.57 U1.J6 ; 43.85,11.52 43.85,12.07 42,12.07 ; U1.E18 38.53,12.17 v1(38.53,12.18) ; v1(29.79,13.65) 32.57,13.65 v1(32.57,10.97) ; 42,12.07 41.78,12.07 U1.D10 ; 42,12.07 42,12.4 v1(41.96,12.4) ; v1(36.91,7.56) 36.58,7.56 U1.M18
VCC-PG: length 343.7
  Top Layer w0.254: v1(95.09,13.83) 96.37,13.83 C40.2 ; v1(48.29,19.19) 47.21,19.19 C63.2 ; C24.2 81.72,1.02 v1(82.41,1.02) ; v1(55.56,10.46) 52.41,10.46 R10.2 ; U3.15 18.03,11.14 v1(18.03,12.56) ; v1(77.13,2.19) 76.78,2.19 C56.2 ; v1(8.17,16.26) 5.34,16.26 C25.2 ; C57.2 77.57,6.72 77.57,4.97 78.96,4.97 78.96,2.18 v1(78.6,2.18) ; v1(88.74,17.06) 89.76,17.06 C58.2 ; 3.18,11.46 v1(5.09,11.46) ; 3.18,11.46 3.18,11.06 0.84,11.06 0.84,4.49 0.92,4.49 0.92,3.58 1.79,3.58 C41.2 ; 3.18,11.46 R7.2 ; v1(7.52,0.62) 6.72,0.62 C26.1 ; v1(40.82,12.82) 40.82,12.99 42.96,12.99 v1(42.96,12.72)
  Inner2 w0.254: v1(82.41,1.02) 77.13,1.02 v1(77.13,2.19) 78.6,2.19 v1(78.6,2.18) ; v1(55.56,10.46) 55.43,10.46 55.43,19.19 v1(48.29,19.19) 42.96,19.19 v1(42.96,12.72) ; v1(7.52,0.62) 7.45,0.62 7.45,8.47 ; v1(5.09,11.46) 5.09,8.47 ; 5.09,8.47 7.45,8.47 ; 5.09,8.47 3.52,8.47 3.52,18.6 3.69,18.6 3.69,19.08 9.2,19.08 9.2,19.44 40.82,19.44 v1(40.82,12.82) 40.82,10.23 v1(37.94,10.23) ; 7.45,8.47 8.17,8.47 v1(8.17,16.26) ; v1(39.2,6.03) 34.5,6.03 34.5,6.75 33.33,6.75 33.33,6.66 27.15,6.66 27.15,12.56 v1(18.03,12.56) ; v1(95.09,13.83) 88.74,13.83 v1(88.74,17.06)
  Bottom Layer w0.254: 82.48,15.8 71.59,15.8 U2.F1 ; 82.48,15.8 82.48,19.19 v1(48.29,19.19) ; 82.48,15.8 82.48,15.41 ; U1.D12 40.48,12.85 41.13,12.85 U1.D11 v1(40.82,12.82) ; 8.17,12.72 8.17,10.22 25.93,10.22 25.93,10.48 27.1,10.48 27.1,10.22 U1.H20 ; 8.17,12.72 18.03,12.72 v1(18.03,12.56) ; 8.17,12.72 v1(8.17,16.26) ; U2.F12 71.59,2.19 v1(77.13,2.19) ; U2.U1 78.74,15.41 82.48,15.41 ; v1(42.96,12.72) 42.96,12.82 U1.D7 ; 82.48,15.41 82.48,13.02 83.68,13.02 ; 83.68,13.02 95.09,13.02 v1(95.09,13.83) ; 83.68,13.02 83.68,1.02 v1(82.41,1.02) ; U1.F18 37.94,11.52 v1(37.94,10.23) 37.94,10.22 U1.H17 ; U1.L14 39.18,6.03 v1(39.2,6.03)
VCC-RTC: length 32.4
  Top Layer w0.254: v1(12.4,1.89) 12.4,1.04 R14.2 ; v1(22.05,8.19) 22.22,8.19 22.22,9.33 U3.7 ; C59.2 10.06,3.32 v1(10.06,2.25)
  Bottom Layer w0.254: v1(10.06,2.25) 10.06,1.89 ; 10.06,1.89 6.84,1.89 6.84,8.11 22.05,8.11 v1(22.05,8.19) ; 10.06,1.89 v1(12.4,1.89)
VDD-CPU: length 195.8
  Top Layer w0.254: v1(12.15,14.76) 12.15,15.97 L2.2 ; v1(9.9,17.51) 11.05,17.51 C22.2 ; v1(52.84,12.92) 52.52,12.92 52.52,13.94 33.17,13.94 33.17,11.95 C5.2 ; 52.52,5.23 22.34,5.23 22.34,5.53 16.76,5.53 C21.2 v1(15.77,4.7) ; 52.52,5.23 52.52,5.49 ; 52.52,5.23 52.52,3.32 ; v1(67.06,5.53) 72.19,5.53 C6.2 ; C23.2 70.19,17.74 v1(69.34,17.74) ; v1(13.44,1.02) 14.45,1.02 C4.2
  Inner2 w0.254: 15.77,1.02 15.77,0.87 48.53,0.87 48.53,1.02 ; 15.77,1.02 v1(15.77,4.7) ; 15.77,1.02 v1(13.44,1.02) 13.44,17.51 12.15,17.51 ; 48.53,1.02 48.53,12.92 v1(52.84,12.92) ; 48.53,1.02 67.06,1.02 v1(67.06,5.53) 69.34,5.53 v1(69.34,17.74) ; v1(9.9,17.51) 12.15,17.51 ; 12.15,17.51 v1(12.15,14.76)
  Bottom Layer w0.254: 42.76,10.22 U1.H8 U1.J8 ; 42.76,10.22 42.76,9.57 U1.J10 U1.J11 ; 42.76,10.22 42.43,10.22
VDD-GPU: length 216.2
  Top Layer w0.254: C18.2 83.98,11.28 88.05,11.28 88.05,13.98 88.26,13.98 88.26,15.15 88.05,15.15 88.05,19.01 95.67,19.01 95.67,18.6 97.26,18.6 97.26,11.46 97.56,11.46 97.56,8.62 96.81,8.62 ; v1(42.75,10.87) 49.25,10.87 v1(49.25,11.62) ; C71.2 53.85,7.66 v1(53.85,6.86) ; 29.07,2.04 29.07,2.62 v1(29.21,2.62) ; 29.07,2.04 19.39,2.04 C8.2 ; 29.07,2.04 34.5,2.04 34.5,3.56 51.48,3.56 51.48,1.14 52.52,1.14 52.52,1.71 v1(51.59,1.71) ; 96.81,8.62 96.81,8.75 83.98,8.75 C72.2 ; 96.81,8.62 96.81,7.32 ; 96.81,7.32 97.25,7.32 97.25,3.09 92.5,3.09 92.5,3.3 C9.2 81.92,3.3 81.92,2.47 v1(80.88,2.47) ; 96.81,7.32 C20.2 ; v1(71.96,1.02) 73.25,1.02 C7.2 ; C73.2 31.96,18.65 19.07,18.65 L3.2 19.07,14.76 v1(20.03,14.76)
  Inner2 w0.254: 51.59,3.71 51.59,6.86 v1(53.85,6.86) ; 51.59,3.71 49,3.71 49,11.62 v1(49.25,11.62) ; 51.59,3.71 v1(51.59,1.71) ; v1(21.73,11.54) 21.73,9.37 23.21,9.37 23.21,2.09 29.21,2.09 v1(29.21,2.62)
  Bottom Layer w0.254: U1.F11 U1.G11 ; U1.F11 U1.F10 42.45,11.52 42.45,10.87 ; U1.F11 U1.F12 40.48,11.4 39.83,11.4 U1.F13 ; U1.G11 U1.G10 ; U1.G11 U1.G12 ; 42.45,10.87 v1(42.75,10.87) U1.G8 ; 42.45,10.87 42.43,10.87 ; v1(51.59,1.71) 51.59,1.02 v1(71.96,1.02) 80.88,1.02 v1(80.88,2.47) ; v1(20.03,14.76) 20.03,11.54 v1(21.73,11.54)
AC-AVCC: length 25.4
  Top Layer w0.254: C10.2 23.5,16.88 v1(22.28,16.88)
  Inner2 w0.254: v1(22.28,16.88) 22.28,19.03 36.59,19.03 36.59,12.82 v1(37.25,12.82)
  Bottom Layer w0.254: U1.D18 37.25,12.82 v1(37.25,12.82)
AP-RESET: length 71.6
  Top Layer w0.254: v1(59.69,8.27) 59.69,7.59 63.79,7.59 63.79,9.24 69.57,9.24 69.57,6.62 C74.2 ; v1(49.87,14.9) 49.87,15.43 39.74,15.43 v1(39.74,18.56) ; v1(23.55,15) 23.14,15 R12.2
  Inner2 w0.254: v1(49.87,14.9) 54.83,14.9 54.83,7.21 v1(57.16,7.21)
  Bottom Layer w0.254: v1(23.55,15) 23.55,19.06 39.74,19.06 v1(39.74,18.56) ; v1(57.16,7.21) 59.69,7.21 v1(59.69,8.27)
DCDCE: length 163
  Top Layer w0.254: v1(29.95,16.7) 29.95,16.86 R2.2 ; R16.2 84.27,6.75 v1(84.27,7.5) ; v1(64.53,8.51) 65.14,8.51 L4.1 ; C80.2 v1(4.25,12.56) ; C79.2 59.54,14.33 68.06,14.33 68.06,17.72 65.93,17.72 v1(65.93,17.86) ; v1(9.9,18.83) 8.77,18.83 R3.2 ; v1(85.99,15.85) 83.22,15.85 v1(83.22,14.67) 82.15,14.67 R4.2 ; v1(14.41,12.02) 14.41,11.79 ; 14.41,11.79 U5.3 ; 14.41,11.79 14.31,11.79 14.31,10.52 9.31,10.52 9.31,9.25 ; v1(30.64,13.03) 30.64,14.12 C15.2
  Inner2 w0.254: v1(4.25,12.56) 4.25,18.55 10.08,18.55 ; 10.08,18.55 10.08,18.83 v1(9.9,18.83) ; 10.08,18.55 14,18.55 14,12.91 ; 14,12.91 14,12.02 v1(14.41,12.02) ; 14,12.91 15.27,12.91 15.27,13.14 29.2,13.14 29.2,13.07 30.64,13.07 ; v1(64.53,8.51) 64.53,17.86 v1(65.93,17.86) 65.93,18.89 83.22,18.89 v1(83.22,14.67) ; 30.64,13.07 30.64,16.7 v1(29.95,16.7) ; 30.64,13.07 v1(30.64,13.03) ; v1(84.27,7.5) 85.99,7.5 v1(85.99,15.85)
  Bottom Layer w0.254: v1(29.95,16.7) 29.95,17.33 65.93,17.33 v1(65.93,17.86)
DCXO-XIN: length 107.2
  Top Layer w0.254: v1(74.93,9.73) 74.93,9.53 72.11,9.53 C31.1 ; U7.1 93.09,16.79 v1(92.27,16.79)
  Inner2 w0.254: 83.95,19.3 83.95,13.93 78.68,13.93 78.68,14.36 76.37,14.36 76.37,12.92 74.45,12.92 74.45,9.73 v1(74.93,9.73) ; 83.95,19.3 56.12,19.3 v1(56.12,18.24) ; 83.95,19.3 92.27,19.3 v1(92.27,16.79)
  Bottom Layer w0.254: U1.B11 41.13,15.79 32.28,15.79 32.28,16.08 29.21,16.08 29.21,17.86 56.12,17.86 v1(56.12,18.24)
DCXO-XOUT: length 21.7
  Top Layer w0.254: v1(95.26,15.8) 95.67,15.8 95.67,17.92 U7.3 ; C32.1 87.39,10.7 v1(87.3,10.7)
  Inner2 w0.254: v1(95.26,15.8) 89.48,15.8 89.48,17.8 87.09,17.8 87.09,10.7 v1(87.3,10.7)
RESET: length 49.4
  Top Layer w0.254: v1(26.04,14.24) 24.65,14.24 R12.1 ; v1(32.87,16.37) 37.58,16.37 v1(37.58,14.74) ; R10.1 53.92,9.02 36.51,9.02 36.51,13.31 33.82,13.31 v1(33.82,12.87)
  Inner2 w0.254: v1(33.82,12.87) 33.82,16.37 v1(32.87,16.37) 32.87,17.44 26.04,17.44 v1(26.04,14.24)
  Bottom Layer w0.254: v1(37.58,14.74) 37.58,14.77 U1.A16
SPI0_CLK: length 69.6
  Top Layer w0.254: 9.31,11.79 7.76,11.79 7.76,7.46 v1(8.46,7.46) ; v1(49.25,2.97) 43.63,2.97 v1(43.63,2.55)
  Bottom Layer w0.254: v1(43.63,2.55) 43.63,1.53 22.12,1.53 22.12,2.81 10.64,2.81 10.64,7.46 v1(8.46,7.46) ; v1(49.25,2.97) 50.28,2.97 50.28,14.12 U1.B1
SPI0_CS0: length 25.6
  Top Layer w0.254: U5.1 17.14,9.25 v1(17.14,8.77) ; v1(23.94,9.55) 23.8,9.55 23.8,9.72 25.88,9.72 25.88,10.98 29.88,10.98 v1(29.88,11.08) ; v1(31.49,15.5) 28.68,15.5 R2.1
  Inner2 w0.254: v1(31.49,15.5) 31.49,11.08 v1(29.88,11.08)
  Bottom Layer w0.254: v1(17.14,8.77) 17.14,9.38 23.94,9.38 v1(23.94,9.55)
SPI0_MISO: length 33.2
  Top Layer w0.254: R3.1 8.77,17.54 v1(8,17.54) ; U5.2 16.38,10.91 v1(14.89,10.91)
  Bottom Layer w0.254: v1(14.89,10.91) 22.64,10.91 22.64,16.16 16.13,16.16 16.13,18.17 8,18.17 v1(8,17.54)
SPI0_MOSI: length 61.9
  Top Layer w0.254: 9.31,13.06 14.69,13.06 v1(14.69,13.49)
  Inner2 w0.254: v1(14.69,13.49) 14.69,15.58 23.02,15.58 23.02,18 35.02,18 35.02,6.82 43.69,6.82 43.69,13.35 v1(48.03,13.35)
  Bottom Layer w0.254: v1(48.03,13.35) 48.03,13.47 U1.C1
U1_A6: length 8.9
  Top Layer w0.254: v1(44.07,14.72) 38.39,14.72 R9.1
  Bottom Layer w0.254: v1(44.07,14.72) 44.07,14.77 U1.A6
U1_K1: length 13
  Top Layer w0.254: R1.1 53.92,12.74 v1(53.94,12.74)
  Inner2 w0.254: v1(49.64,8) 53.94,8 v1(53.94,12.74)
  Bottom Layer w0.254: v1(49.64,8) 49.64,8.92 U1.K1
U3_3: length 8
  Top Layer w0.254: L1.2 21.38,2.86 v1(21.38,3.55) ; v1(19.79,7.34) 20.04,7.34 U3.3
  Inner2 w0.254: v1(19.79,7.34) 21.38,7.34 v1(21.38,3.55)
U4_1: length 46.4
  Top Layer w0.254: C78.2 87.41,1.01 R15.1 89.48,0.65 v1(90.61,0.65) ; U4.1 79.99,12.29 79.99,13.68 86.53,13.68 86.53,14.57 v1(87.68,14.57)
  Bottom Layer w0.254: v1(90.61,0.65) 90.61,0.58 95.13,0.58 95.13,4.49 97.71,4.49 97.71,14.57 v1(87.68,14.57)
U4_3: length 27.3
  Top Layer w0.254: U4.3 76.54,14.8 v1(75.63,14.8) ; v1(67.18,8.61) 67.6,8.61 L4.2
  Inner2 w0.254: v1(70.13,16.72) 75.63,16.72 v1(75.63,14.8) ; v1(67.18,8.61) 67.18,18.31 v1(67.43,18.31)
  Bottom Layer w0.254: v1(67.43,18.31) 67.43,18.47 70.13,18.47 v1(70.13,16.72)
USB1_1: length 7
  Inner2 w0.254: 25.59,5.93 USB1.1 32.54,5.93
USB1_2: length 19.8
  Inner2 w0.254: 30.07,8.95 USB1.2 28.07,8.95 ; 24.57,3.7 USB1.2 33.57,3.7
  Bottom Layer w0.254: 24.57,3.7 28.07,3.7 28.07,8.95

## Copper pours and planes (outline as drawn; the poured copper is in the pictures)
GND on GND: 12.7,8.49 14.2,8.49 14.2,6.98 12.7,6.98
GND on GND: 3.53,14.37 4.54,14.37 4.54,13.36 3.53,13.36
GND on GND: 20.7,8.49 22.2,8.49 22.2,6.98 20.7,6.98
GND on GND: 4.85,7.91 7.86,7.91 7.86,5.25 4.85,5.25
GND on GND: 3.53,7.42 4.54,7.42 4.54,6.41 3.53,6.41
GND on GND: 4.8,15.53 7.86,15.53 7.86,13.23 4.8,13.23
GND on GND: 6.55,12.04 7.56,12.04 7.56,10.74 6.55,10.74
GND on GND: 0,20 100,20 100,0 0,0
GND on GND: 0.45,6.54 3.16,6.54 3.16,5.24 0.45,5.24
GND on GND: 6.55,10.04 7.56,10.04 7.56,8.74 6.55,8.74
GND on GND: 0.45,15.54 3.16,15.54 3.16,14.24 0.45,14.24
